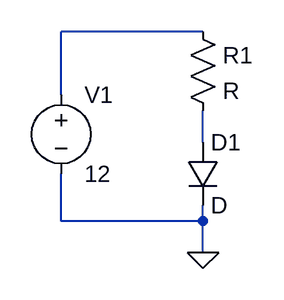
[diagram p0: schematic led_circuit.asc]
led_circuit.asc, the LTspice schematic file:
Version 4
SHEET 1 880 680
WIRE 208 96 64 96
WIRE 64 160 64 96
WIRE 208 208 208 176
WIRE 64 288 64 240
WIRE 208 288 208 272
WIRE 208 288 64 288
WIRE 208 320 208 288
FLAG 208 320 0
SYMBOL res 192 80 R0
SYMATTR InstName R1
SYMBOL diode 192 208 R0
SYMATTR InstName D1
SYMBOL voltage 64 144 R0
WINDOW 123 0 0 Left 2
WINDOW 39 0 0 Left 2
SYMATTR InstName V1
SYMATTR Value 12

The netlist it stands for:
* led_circuit.asc
R1 N001 N002 R
D1 N002 0 D
V1 N001 0 12
.model D D
.lib standard.dio
.backanno
.end